# Altium schematic sheet 4_Digital_Isolator.SchDoc: Digital_Isolator
size A4; ApprovedBy: Alcatraz; CheckedBy: Alcatraz; Author: Alcatraz; CompanyName: DHNLAB; DrawnBy: Alcatraz; Engineer: Alcatraz; Organization: DHNLAB PVT LTD; Address1: DHANBAD; Address2: JHARKHAND; Address3: INDIA; Address4: ASIA; DocumentNumber: 4; Revision: 1.0; SheetNumber: 4; SheetTotal: 6; ProjectTitle: USB-SMB-ISO-CP2112
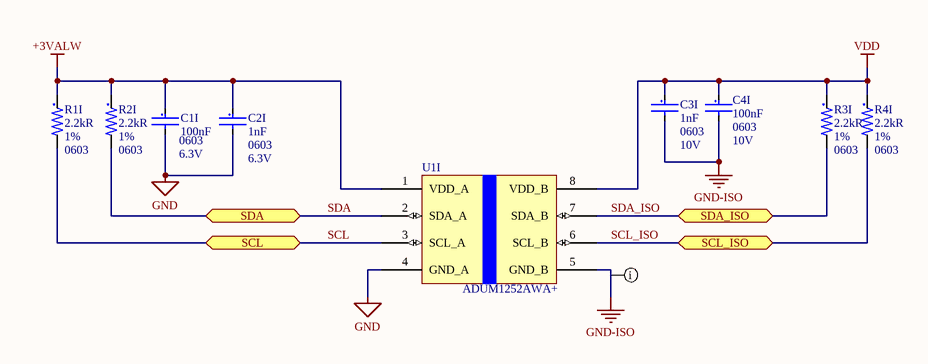
[diagram p0: 4_Digital_Isolator.SchDoc]

## Parts
C1I  value 100nF  Voltage: 6.3V  Package: 0603  [C0603-IPC_C_No_Silk]  (hidden comment: KGM15AR70J104KM)
C2I  value 1nF  Case Code (Imperial): 0603  Voltage Rating: 6.3V  [C0603-IPC_C_No_Silk]  (hidden comment: 06036A102KAT2A)
C3I  value 1nF  Case Code (Imperial): 0603  Voltage Rating: 10V  [C0603-IPC_C_No_Silk]  (hidden comment: CC0603KRX7R6BB102)
C4I  value 100nF  Voltage: 10V  Case/Package: 0603  [C0603-IPC_C_No_Silk]  (hidden comment: C0603C104K8RACTU)
R1I  value 2.2kR  Tolerance: 1%  Case/Package: 0603  [R0603-MFG]  (hidden comment: RC0603FR-072K2L)
R2I  value 2.2kR  Tolerance: 1%  Case/Package: 0603  [R0603-MFG]  (hidden comment: RC0603FR-072K2L)
R3I  value 2.2kR  Tolerance: 1%  Case/Package: 0603  [R0603-MFG]  (hidden comment: RC0603FR-072K2L)
R4I  value 2.2kR  Tolerance: 1%  Case/Package: 0603  [R0603-MFG]  (hidden comment: RC0603FR-072K2L)
U1I  ADUM1252AWA+  [SOIC-W-8-IPC_A]

## Ports
SCL (bidir), SCL_ISO (bidir), SDA (bidir), SDA_ISO (bidir)

## Nets
+3VALW: C1I.1 C2I.1 R1I.1 R2I.1 U1I.1(VDD_A)
GND: C1I.2 C2I.2 U1I.4(GND_A)
GND-ISO: C3I.2 C4I.2 U1I.5(GND_B)
VDD: C3I.1 C4I.1 R3I.1 R4I.1 U1I.8(VDD_B)
SCL: R1I.2 U1I.3(SCL_A) ; port SCL
SCL_ISO: R4I.2 U1I.6(SCL_B) ; port SCL_ISO
SDA: R2I.2 U1I.2(SDA_A) ; port SDA
SDA_ISO: R3I.2 U1I.7(SDA_B) ; port SDA_ISO

## Layout directives
net class GND; net class PowerRails_GND: GND-ISO

## Notes on the sheet
- Title:
- Author:
- Approved:
- Size:
- Date:
- Git Hash:
- A4
- Prj:
- SW Version:
- Variant:
- Edited:
- PUBLIC
- File:

## Library data of the parts
C1I = 100nF_6.3V: Cap Cer 0.1UF 6.3V X7R 0603; Manufacturer: KYOCERA AVX; Tol: 10%; Supplier 1: Digikey; Manufacturer Part Number: KGM15AR70J104KM; Category: Ceramic Capacitors; Stock 1: 117167; Pricing 1: 1=0.1, 10=0.032, 50=0.0186, 100=0.0144, 500=0.01082, 1000=0.0085, 2500=0.00772, 5000=0.00711 (USD); Supplier Part Number 1: 478-KGM15AR70J104KMCT-ND
C2I = 1nF_6.3V: Cap Ceramic 0.001uF 6.3V C0G 10% SMD 0603 125°C Paper T/R; Manufacturer: Kyocera AVX; Supplier 1: Avnet; Manufacturer Part Number: 06036A102KAT2A; RoHS: Yes; Category: Ceramic Capacitors; Mounting Technology: Surface Mount; Case/Package: 0603; Pins: 2; Case Code (Metric): 1608; Min Operating Temperature: -55°C; Max Operating Temperature: 125°C; Packaging: Tape and Reel; Tolerance: 10%; Package Quantity: 4000; Voltage Rating (DC): 6.3V; Dielectric: C0G; Termination: SMD/SMT; Series: -; Construction: Flat; Length: 1.6mm; Width: 0.032inch; Depth: 0.81mm; Thickness: 0.035inch; RoHS Compliant: Yes; ComponentLink1URL: https://datasheet.ciiva.com/6265/ccog-6265066.pdf?src-supplier=Digikey; ComponentLink1Description: https://datasheet.ciiva.com/6265/ccog-6265066.pdf?src-supplier=Digikey; Supplier Part Number 1: 06036A102KAT2A
C3I = 1nF_10V: Cap Ceramic 0.001uF 10V X7R 10% SMD 0603 125°C Paper T/R; Manufacturer: Yageo; Supplier 1: Future Electronics; Manufacturer Part Number: CC0603KRX7R6BB102; RoHS: Yes; Category: Ceramic Capacitors; Mounting Technology: Surface Mount; Case/Package: 0603; Case Code (Metric): 1608; Min Operating Temperature: -55°C; Max Operating Temperature: 125°C; Packaging: Tape and Reel; Tolerance: 10%; Voltage Rating (DC): 10V; Dielectric: X7R; Termination: Wraparound; Series: CC; Construction: Flat; Length: 0.063inch; Width: 0.031inch; Thickness: 0.035inch; RoHS Compliant: Yes; ComponentLink1URL: https://datasheet.ciiva.com/13210/upy-gphc-x7r-6-3v-to-50v-8-12304-13210264.pdf?src-supplier=Mouser; ComponentLink1Description: https://datasheet.ciiva.com/13210/upy-gphc-x7r-6-3v-to-50v-8-12304-13210264.pdf?src-supplier=Mouser; Supplier Part Number 1: 6091492; Stock 1: 16000; Pricing 1: 4000=0.0036, 16000=0.0035, 80000=0.0033, 160000=0.0033, 500000=0.0031 (USD); Height: 0.8mm; Lead Free: Lead Free; Halogen Free: Halogen Free
C4I = 100nF_10V: Multilayer Ceramic Capacitor, 0.1 uF, 10 V, ± 10%, X7R, 0603 [1608 Metric]; Manufacturer: KEMET; Material: 4241ConductorMaterial; Dissipation Factor: 5%; Temperature Coefficient: 30ppm/°C; Supplier 1: Mouser; Manufacturer Part Number: C0603C104K8RACTU; Category: Ceramic Capacitors; Stock 1: 246409; Pricing 1: 1=0.11, 10=0.075, 50=0.075, 100=0.036, 1000=0.021, 10000=0.017 (USD); Supplier Part Number 1: 80-C0603C104K8R; RoHS: Yes; Mounting Technology: Surface Mount,PCB; Pins: 2; Case Code (Imperial): 0603; Case Code (Metric): 1608; Dielectric Material: Ceramic; Min Operating Temperature: -55°C; Max Operating Temperature: 125°C; Tolerance: 10%; Voltage Rating: 10V; Packaging: Tape and Reel; Dielectric: X7R; Series: C; Package Quantity: 1; Termination: SMD/SMT; Construction: Flat; Length: 1.6mm; Width: 0.031inch; Height: 0.8mm; Thickness: 0.034inch; Lead Pitch: 0.7mm; Depth: 0.8mm; Radiation Hardening: No; Reach SVHC Compliant: No; RoHS Compliant: Yes; Lead Free: 5697LeadFree; ComponentLink1URL: https://datasheet.ciiva.com/6093/1776114-6093269.pdf?src-supplier=Farnell; ComponentLink1Description: https://datasheet.ciiva.com/6093/1776114-6093269.pdf?src-supplier=Farnell; ComponentLink2URL: https://datasheet.ciiva.com/7823/kem-c1002-x7r-smd-7823989.pdf?src-supplier=Element14; ComponentLink2Description: https://datasheet.ciiva.com/7823/kem-c1002-x7r-smd-7823989.pdf?src-supplier=Element14; ComponentLink3URL: https://datasheet.ciiva.com/22693/1851736-22693967.pdf?src-supplier=Element14; ComponentLink3Description: https://datasheet.ciiva.com/22693/1851736-22693967.pdf?src-supplier=Element14; ComponentLink4URL: https://datasheet.ciiva.com/14589/70095383-14589402.pdf?src-supplier=Allied+Electronics; ComponentLink4Description: https://datasheet.ciiva.com/14589/70095383-14589402.pdf?src-supplier=Allied+Electronics; ComponentLink5URL: https://datasheet.ciiva.com/14593/70095383-14593978.pdf?src-supplier=Allied+Electronics; ComponentLink5Description: https://datasheet.ciiva.com/14593/70095383-14593978.pdf?src-supplier=Allied+Electronics; ComponentLink6URL: https://datasheet.ciiva.com/5419/kem-c1002-x7r-smd-357932-5419657.pdf?src-supplier=Mouser; ComponentLink6Description: https://datasheet.ciiva.com/5419/kem-c1002-x7r-smd-357932-5419657.pdf?src-supplier=Mouser; ComponentLink7URL: https://datasheet.ciiva.com/18192/getdatasheetpartid-91529-18192711.pdf?src-supplier=Verical; ComponentLink7Description: https://datasheet.ciiva.com/18192/getdatasheetpartid-91529-18192711.pdf?src-supplier=Verical; Voltage Rating (DC): 10V
R1I R2I R3I R4I = 2.2K: SMD Chip Resistor, 2.2 kOhm, ± 1%, 100 mW, 0603 [1608 Metric], Thick Film, General Purpose; Manufacturer: Yageo; Power Rating: 100mW; Temperature Coefficient: 100ppm/°C; Voltage Rating: 50V; Supplier 1: Future Electronics; Manufacturer Part Number: RC0603FR-072K2L; RoHS: Yes; Category: Chip SMD Resistors; Stock 1: 6755000; Pricing 1: 5000=0.0026, 75000=0.001, 100000=0.0024, 200000=0.001, 375000=0.0023, 500000=0.0009, 1250000=0.0022, 5000000=0.002 (USD); Case Code (Imperial): 0603; Case Code (Metric): 1608; Min Operating Temperature: -55°C; Max Operating Temperature: 155°C; Packaging: Tape and Reel; Series: RC; RoHS Compliant: Yes; Lead Free: Lead Free; Supplier Part Number 1: 6372452; Max Power Dissipation: 100mW; Features: Moisture Resistant; Number of Terminations: 2; ComponentLink1URL: https://datasheet.ciiva.com/2453/pyu-r-int-thick-7-2453943.pdf?src-supplier=Digikey; ComponentLink1Description: https://datasheet.ciiva.com/2453/pyu-r-int-thick-7-2453943.pdf?src-supplier=Digikey; ComponentLink2URL: https://datasheet.ciiva.com/2453/pyu-r-int-thick-7-2453944.pdf?src-supplier=Digikey; ComponentLink2Description: https://datasheet.ciiva.com/2453/pyu-r-int-thick-7-2453944.pdf?src-supplier=Digikey; ComponentLink3URL: https://datasheet.ciiva.com/2453/pyu-r-int-thick-7-2453945.pdf?src-supplier=Digikey; ComponentLink3Description: https://datasheet.ciiva.com/2453/pyu-r-int-thick-7-2453945.pdf?src-supplier=Digikey; ComponentLink4URL: https://datasheet.ciiva.com/7660/1868787-7660791.pdf?src-supplier=Element14; ComponentLink4Description: https://datasheet.ciiva.com/7660/1868787-7660791.pdf?src-supplier=Element14; Resistor Type: Thick Film; Resistance Tolerance: 1%; Reach SVHC Compliant: Unknown; ComponentLink5URL: https://datasheet.ciiva.com/46394/443971-46394958.pdf?src-supplier=Element14; ComponentLink5Description: https://datasheet.ciiva.com/46394/443971-46394958.pdf?src-supplier=Element14
U1I = ADUM1252AWA+: Ultra-Low Power, Bidirectional I2C Isolator with Extended VDD, Idle-Bus Hot-Swap and Low VOL; Manufacturer: Analog Devices; Supplier 1: Mouser; Supplier Part Number 1: 584-ADUM1252AWA+; Manufacturer Part Number: ADUM1252AWA+; RoHS: No; Stock 1: 216; Pricing 1: 1=4.29, 10=3.85, 50=3.85, 100=3.15, 1000=2.68, 10000=2.14 (USD)